# EAGLE design Auto2017 (EAGLE 7.7.0)
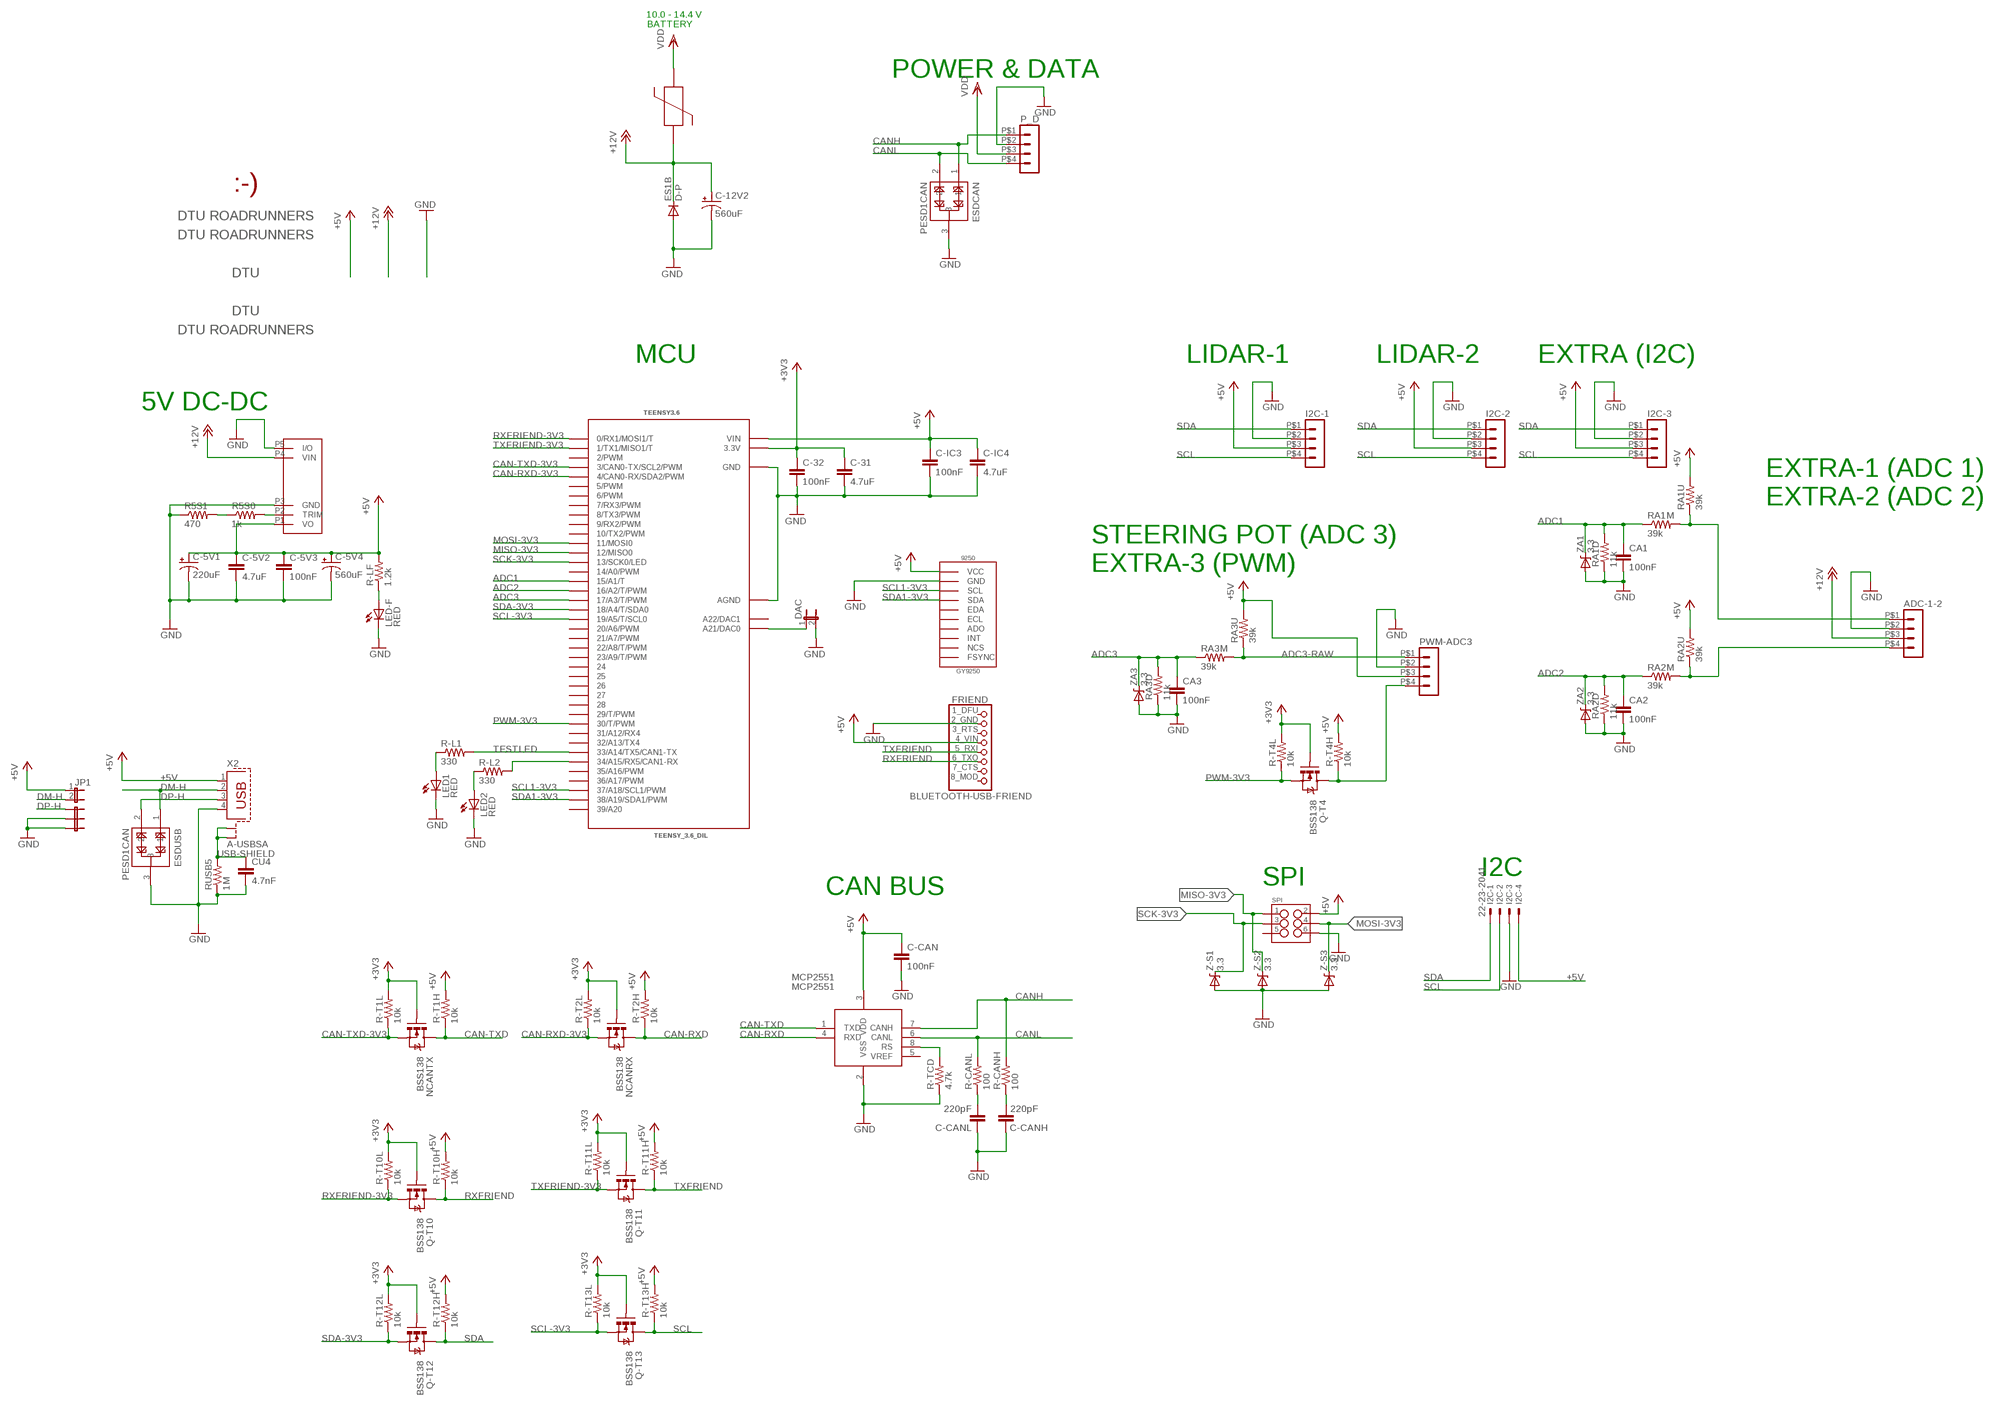
[diagram p0: schematic, sheet 1]

## Parts
9250  GY9250  [GY9250]
ADC-1-2  HEADER_POS4_43045-0401  [43045-0400]
C-5V1  220uF  CPOL-USD  [PANASONIC_D]
C-5V2  4.7uF  CAP1210  [1210]
C-5V3  100nF  CAP0805  [0805]
C-5V4  560uF  CPOL-USG  [PANASONIC_G]
C-12V2  560uF  CPOL-USG  [PANASONIC_G]
C-31  4.7uF  CAP1210  [1210]
C-32  100nF  CAP0805  [0805]
C-CAN  100nF  CAP0805  [0805]
C-CANH  220pF  CAP0805  [0805]
C-CANL  220pF  CAP0805  [0805]
C-IC3  100nF  CAP0805  [0805]
C-IC4  4.7uF  CAP1210  [1210]
CA1  100nF  CAP0805  [0805]
CA2  100nF  CAP0805  [0805]
CA3  100nF  CAP0805  [0805]
CU4  4.7nF  CAP0805  [0805]
D-P  ES1B  DIODESMA  [SMA-DIODE]
DAC  JUMPER-2PTH  [1X02]
ESDCAN  PESD1CAN  [SOT23-3]
ESDUSB  PESD1CAN  [SOT23-3]
FRIEND  BLUETOOTH-USB-FRIEND  [1X08_ROUND_76]
I2C  22-23-2041  [22-23-2041]
I2C-1  HEADER_POS4_43045-0401  [43045-0400]
I2C-2  HEADER_POS4_43045-0401  [43045-0400]
I2C-3  HEADER_POS4_43045-0401  [43045-0400]
JP1  JUMPER-2PTH  [1X02]
JP3  JUMPER-3PTH  [1X03]
LED1  RED  LED1206  [LED-1206]
LED2  RED  LED1206  [LED-1206]
LED-F  RED  LED1206  [LED-1206]
MAIN_FUSE  SMF_OMNI-BLOK_FUSE_BLOCK  [SMF_OMNI-BLOK_FUSE_BLOCK]
MCP2551  MCP2551  [SO-08M]
NCANRX  BSS138  MOSFET-NCHANNELBSS123LT1G  [SOT23-3]
NCANTX  BSS138  MOSFET-NCHANNELBSS123LT1G  [SOT23-3]
P_D  HEADER_POS4_43045-0401  [43045-0400]
PWM-ADC3  HEADER_POS4_43045-0401  [43045-0400]
Q-T4  BSS138  MOSFET-NCHANNELBSS123LT1G  [SOT23-3]
Q-T10  BSS138  MOSFET-NCHANNELBSS123LT1G  [SOT23-3]
Q-T11  BSS138  MOSFET-NCHANNELBSS123LT1G  [SOT23-3]
Q-T12  BSS138  MOSFET-NCHANNELBSS123LT1G  [SOT23-3]
Q-T13  BSS138  MOSFET-NCHANNELBSS123LT1G  [SOT23-3]
R5S0  1k  RESISTOR0805-RES  [0805]
R5S1  470  RESISTOR0805-RES  [0805]
R-CANH  100  RESISTOR0805-RES  [0805]
R-CANL  100  RESISTOR0805-RES  [0805]
R-L1  330  RESISTOR0805-RES  [0805]
R-L2  330  RESISTOR0805-RES  [0805]
R-LF  1.2k  RESISTOR0805-RES  [0805]
R-T1H  10k  RESISTOR0805-RES  [0805]
R-T1L  10k  RESISTOR0805-RES  [0805]
R-T2H  10k  RESISTOR0805-RES  [0805]
R-T2L  10k  RESISTOR0805-RES  [0805]
R-T4H  10k  RESISTOR0805-RES  [0805]
R-T4L  10k  RESISTOR0805-RES  [0805]
R-T10H  10k  RESISTOR0805-RES  [0805]
R-T10L  10k  RESISTOR0805-RES  [0805]
R-T11H  10k  RESISTOR0805-RES  [0805]
R-T11L  10k  RESISTOR0805-RES  [0805]
R-T12H  10k  RESISTOR0805-RES  [0805]
R-T12L  10k  RESISTOR0805-RES  [0805]
R-T13H  10k  RESISTOR0805-RES  [0805]
R-T13L  10k  RESISTOR0805-RES  [0805]
R-TCD  4.7k  RESISTOR0805-RES  [0805]
RA1D  11k  RESISTOR0805-RES  [0805]
RA1M  39k  RESISTOR0805-RES  [0805]
RA1U  39k  RESISTOR0805-RES  [0805]
RA2D  11k  RESISTOR0805-RES  [0805]
RA2M  39k  RESISTOR0805-RES  [0805]
RA2U  39k  RESISTOR0805-RES  [0805]
RA3D  11k  RESISTOR0805-RES  [0805]
RA3M  39k  RESISTOR0805-RES  [0805]
RA3U  39k  RESISTOR0805-RES  [0805]
RUSB5  1M  RESISTOR0805-RES  [0805]
SPI  M03X2POGO_PINS  [2X3_POGO]
TEENSY3.6  TEENSY_3.6_DIL  [TEENSY_3.6_DIL]
U$1  AXA003A0XZ  [SIP]
U$3  DTUMEDIUM-9MM  [DTU-MEDIUM-9MM]
U$4  ROADRUNNERSFULL  [ROADRUNNERS-FULL]
U$5  ROADRUNNERSSMALL  [ROADRUNNERS-SMALL]
U$6  SMILEY  [SMILEY]
U$8  DTUSMALL  [DTU-SMALL-5MM]
U$9  ROADRUNNERSFULL  [ROADRUNNERS-FULL]
X2  A-USBSA  [USB-A]
Z-S1  3.3  ZENER  [SOD123]
Z-S2  3.3  ZENER  [SOD123]
Z-S3  3.3  ZENER  [SOD123]
ZA1  3.3  ZENER  [SOD123]
ZA2  3.3  ZENER  [SOD123]
ZA3  3.3  ZENER  [SOD123]

## Nets
+3V3: C-31.1 C-32.1 NCANRX.1(G) NCANTX.1(G) Q-T4.1(G) Q-T10.1(G) Q-T11.1(G) Q-T12.1(G) Q-T13.1(G) R-T1L.2 R-T2L.2 R-T4L.2 R-T10L.2 R-T11L.2 R-T12L.2 R-T13L.2 TEENSY3.6.3.3V TEENSY3.6.3.3V3(3.3V)
+5V: 9250.P$VCC(VCC) C-5V1.+ C-5V2.1 C-5V3.1 C-5V4.+ C-CAN.1 C-IC3.1 C-IC4.1 FRIEND.4_VIN I2C-1.P$3 I2C-2.P$3 I2C-3.P$3 I2C.4 JP1.1 MCP2551.3(VDD) PWM-ADC3.P$3 R-LF.2 R-T1H.2 R-T2H.2 R-T4H.2 R-T10H.2 R-T11H.2 R-T12H.2 R-T13H.2 RA1U.2 RA2U.2 RA3U.2 SPI.P$2 TEENSY3.6.VIN U$1.P1(VO) X2.1
+12V: ADC-1-2.P$3 C-12V2.+ D-P.C MAIN_FUSE.PIN1 U$1.P4(VIN)
ADC1: CA1.1 RA1D.2 RA1M.1 TEENSY3.6.15/A1(15/A1/T) ZA1.C
ADC1-RAW: ADC-1-2.P$1 RA1M.2 RA1U.1
ADC2: CA2.1 RA2D.2 RA2M.1 TEENSY3.6.16/A2(16/A2/T/PWM) ZA2.C
ADC2-RAW: ADC-1-2.P$4 RA2M.2 RA2U.1
ADC3: CA3.1 RA3D.2 RA3M.1 TEENSY3.6.17/A3(17/A3/T/PWM) ZA3.C
ADC3-RAW: PWM-ADC3.P$1 RA3M.2 RA3U.1
CAN-RXD: MCP2551.4(RXD) NCANRX.3(D) R-T2H.1
CAN-RXD-3V3: NCANRX.2(S) R-T2L.1 TEENSY3.6.4(4/CAN0-RX/SDA2/PWM)
CAN-TXD: MCP2551.1(TXD) NCANTX.3(D) R-T1H.1
CAN-TXD-3V3: NCANTX.2(S) R-T1L.1 TEENSY3.6.3(3/CAN0-TX/SCL2/PWM)
CANH: ESDCAN.1 MCP2551.7(CANH) P_D.P$1 R-CANH.2
CANL: ESDCAN.2 MCP2551.6(CANL) P_D.P$4 R-CANL.2
DM-H: ESDUSB.1 JP1.2 X2.2
DP-H: ESDUSB.2 JP3.1 X2.3
GND: 9250.P$GND(GND) ADC-1-2.P$2 C-5V1.- C-5V2.2 C-5V3.2 C-5V4.- C-12V2.- C-31.2 C-32.2 C-CAN.2 C-CANH.1 C-CANL.1 C-IC3.2 C-IC4.2 CA1.2 CA2.2 CA3.2 CU4.2 D-P.A DAC.2 ESDCAN.3 ESDUSB.3 FRIEND.2_GND I2C-1.P$2 I2C-2.P$2 I2C-3.P$2 I2C.3 JP3.2 JP3.3 LED1.C LED2.C LED-F.C MCP2551.2(VSS) P_D.P$2 PWM-ADC3.P$2 R5S1.1 R-TCD.1 RA1D.1 RA2D.1 RA3D.1 RUSB5.1 SPI.P$6 TEENSY3.6.AGND TEENSY3.6.GND TEENSY3.6.GND1(GND) U$1.P3(GND) U$1.P5(I/O) X2.4 Z-S1.A Z-S2.A Z-S3.A ZA1.A ZA2.A ZA3.A
MISO-3V3: SPI.P$1 TEENSY3.6.12(12/MISO0) Z-S2.C
MOSI-3V3: SPI.P$4 TEENSY3.6.11(11/MOSI0) Z-S3.C
N$1: LED1.A R-L1.1
N$2: LED2.A R-L2.1
N$3: R5S0.1 R5S1.2
N$4: R-L2.2 TEENSY3.6.34/A15(34/A15/RX5/CAN1-RX)
N$5: DAC.1 TEENSY3.6.A21(A21/DAC0)
N$6: R5S0.2 U$1.P2(TRIM)
N$12: LED-F.A R-LF.1
N$25: C-CANL.2 R-CANL.1
N$26: C-CANH.2 R-CANH.1
PWM-3V3: Q-T4.2(S) R-T4L.1 TEENSY3.6.30(30/T/PWM)
PWM-5V: PWM-ADC3.P$4 Q-T4.3(D) R-T4H.1
RS: MCP2551.8(RS) R-TCD.2
RXFRIEND: FRIEND.6_TXO Q-T10.3(D) R-T10H.1
RXFRIEND-3V3: Q-T10.2(S) R-T10L.1 TEENSY3.6.0(0/RX1/MOSI1/T)
SCK-3V3: SPI.P$3 TEENSY3.6.13(13/SCK0/LED) Z-S1.C
SCL: I2C-1.P$4 I2C-2.P$4 I2C-3.P$4 I2C.2 Q-T13.3(D) R-T13H.1
SCL1-3V3: 9250.P$SCL(SCL) TEENSY3.6.37/A18(37/A18/SCL1/PWM)
SCL-3V3: Q-T13.2(S) R-T13L.1 TEENSY3.6.19/A5(19/A5/T/SCL0)
SDA: I2C-1.P$1 I2C-2.P$1 I2C-3.P$1 I2C.1 Q-T12.3(D) R-T12H.1
SDA1-3V3: 9250.P$SDA(SDA) TEENSY3.6.38/A19(38/A19/SDA1/PWM)
SDA-3V3: Q-T12.2(S) R-T12L.1 TEENSY3.6.18/A4(18/A4/T/SDA0)
TESTLED: R-L1.2 TEENSY3.6.33/A14(33/A14/TX5/CAN1-TX)
TXFRIEND: FRIEND.5_RXI Q-T11.3(D) R-T11H.1
TXFRIEND-3V3: Q-T11.2(S) R-T11L.1 TEENSY3.6.1(1/TX1/MISO1/T)
USB-SHIELD: CU4.1 RUSB5.2 X2.S1 X2.S2
VDD: MAIN_FUSE.PIN2 P_D.P$3
Unconnected: 9250.P$ADO(ADO) 9250.P$ECL(ECL) 9250.P$EDA(EDA) 9250.P$FSYNC(FSYNC) 9250.P$INT(INT) 9250.P$NCS(NCS) FRIEND.1_DFU FRIEND.3_RTS FRIEND.7_CTS FRIEND.8_MOD MCP2551.5(VREF) SPI.P$5 TEENSY3.6.2(2/PWM) TEENSY3.6.5(5/PWM) TEENSY3.6.6(6/PWM) TEENSY3.6.7(7/RX3/PWM) TEENSY3.6.8(8/TX3/PWM) TEENSY3.6.9(9/RX2/PWM) TEENSY3.6.10(10/TX2/PWM) TEENSY3.6.14/A0(14/A0/PWM) TEENSY3.6.20/A6(20/A6/PWM) TEENSY3.6.21/A7(21/A7/PWM) TEENSY3.6.22/A8(22/A8/T/PWM) TEENSY3.6.23/A9(23/A9/T/PWM) TEENSY3.6.24 TEENSY3.6.25 TEENSY3.6.26 TEENSY3.6.27 TEENSY3.6.28 TEENSY3.6.29(29/T/PWM) TEENSY3.6.31/A12(31/A12/RX4) TEENSY3.6.32/A13(32/A13/TX4) TEENSY3.6.35/A16(35/A16/PWM) TEENSY3.6.36/A17(36/A17/PWM) TEENSY3.6.39/A20 TEENSY3.6.A22(A22/DAC1)

## Notes on the sheet
- 10.0 - 14.4 V
- BATTERY
- POWER & DATA
- MCU | LIDAR-1 | LIDAR-2 | EXTRA (I2C)
- 5V DC-DC
- EXTRA-1 (ADC 1)
  EXTRA-2 (ADC 2)
- STEERING POT (ADC 3)
  EXTRA-3 (PWM)
- I2C
- SPI
- CAN BUS

## Library data of the parts
9250 = GY9250:GY9250: GY9250/6500 MPU-9250 module (3 axis accelerator, 3 axis gyro and 3 axis magnetometer) Chip: MPU9250; Power voltage: 3~5V Communication mode: I2C / SPI; Gyro range: +/-250, +/-500, +/-1000, +/-2000dps Accelerator range: +/-2G, +/-4G, +/-8G, +/-16G Magnetometer range: +/-4800uF Pin spacing: 2.54mm Bought from AliExpress <https://www.aliexpress.com/item/SPI-IIC-MPU-9250-9-Axis-Attitude-Gyro-Accelerator-Magnetometer-Sensor-Module/1893522629.html>
ADC-1-2 I2C-1-I2C-3 P_D PWM-ADC3 = con-molex-micro-fit-3_0:HEADER_POS4_?: Molex - Micro-Fit 3.0 Series connector, 3.00mm (0.118") pitch header, 4 positions.
C-5V1 C-5V4 C-12V2 = rcl:CPOL-US: POLARIZED CAPACITOR, American symbol
C-5V2 C-5V3 C-31 C-32 C-CAN C-CANH C-CANL C-IC3 C-IC4 CA1-CA3 CU4 = SparkFun-Passives:CAP: Capacitor Standard 0603 ceramic capacitor, and 0.1" leaded capacitor.
D-P = SparkFun-DiscreteSemi:DIODE: Diode These are standard reverse protection diodes and small signal diodes. SMA package can handle up to about 1A. SOD-323 can handle about 200mA. What the SOD-323 package when ordering, there are some mfgs out there that are 5-pin packages.
DAC JP1 = SparkFun-Retired:JUMPER-2: Jumper Basic 0.1" spaced jumper. Use with breakaway headers.
ESDCAN ESDUSB = SparkFun-DiscreteSemi:PESD1CAN: PESD1CAN is used to protect two automotive CAN bus lines from ESD.; PROD_ID: DIO-12501
FRIEND = BluetoothAndUSBFriend:BLUETOOTH-USB-FRIEND
I2C = con-molex:22-23-2041: .100" (2.54mm) Center Header - 4 Pin; MF: MOLEX; MPN: 22-23-2041; OC_FARNELL: 1462920; OC_NEWARK: 38C0355
JP3 = SparkFun-Retired:JUMPER-3
LED1 LED2 LED-F = SparkFun-LED:LED: LEDs Standard schematic elements and footprints for 5mm, 3mm, 1206, and 0603 sized LEDs. 5mm - Spark Fun Electronics SKU : COM-00529 (and others)
MAIN_FUSE = SMF_OMNI-BLOK_FUSE_BLOCK:SMF_OMNI-BLOK_FUSE_BLOCK
MCP2551 = skpang_lib:MCP2551
NCANRX NCANTX Q-T4 Q-T10-Q-T13 = SparkFun-DiscreteSemi:MOSFET-NCHANNEL: Common NMOSFET Parts MFG P/N Store ID Prod ID FDD8780 TRANS-09984 SI7820DN TRANS-11055 FDS6630A IC-08089 2N7002PW TRANS-11151 FQP30N06L COM-10213 TRANS-10060 BSS123LT1G TRANS-08345 BSS138 TRANS-00830 BS170 2N7000; PROD_ID: TRANS-08345
R5S0 R5S1 R-CANH R-CANL R-L1 R-L2 R-LF R-T1H R-T1L R-T2H R-T2L R-T4H R-T4L R-T10H R-T10L R-T11H R-T11L R-T12H R-T12L R-T13H R-T13L R-TCD RA1D RA1M RA1U RA2D RA2M RA2U RA3D RA3M RA3U RUSB5 = SparkFun-Resistors:RESISTOR: Resistor Basic schematic elements and footprints for 0603, 1206, and PTH resistors.
SPI = SparkFun-Connectors:M03X2: 2x3 .1" header. Shrouded, with keying- CONN-10681 SMT- CONN-11415 Pogo pins- HW-11044; PROD_ID: HW-11044
TEENSY3.6 = Teensy_3_and_LC_Series_Boards_v1.4:TEENSY_3.6_DIL: Teensy 3.6 DIL Package
U$1 = Austin-MiniLynx-DC-DC:AXA003A0XZ: Lineage Power Austin MiniLynx DC-DC Ikke-isoleret DC-DC-konverter, Udgang: 0.75 → 5.5V dc, Udgangsstrøm: 3A RS-varenummer:152-524 Fabrikant: Lineage Power Producentens varenummer: AXA003A0XZ
U$3 U$8 = Logos:DTU
U$4 U$5 U$9 = Logos:ROADRUNNERS
U$6 = Logos:SMILEY
X2 = AssmannUSB:A-USBSA
Z-S1-Z-S3 ZA1-ZA3 = diodes:ZENER

## Board
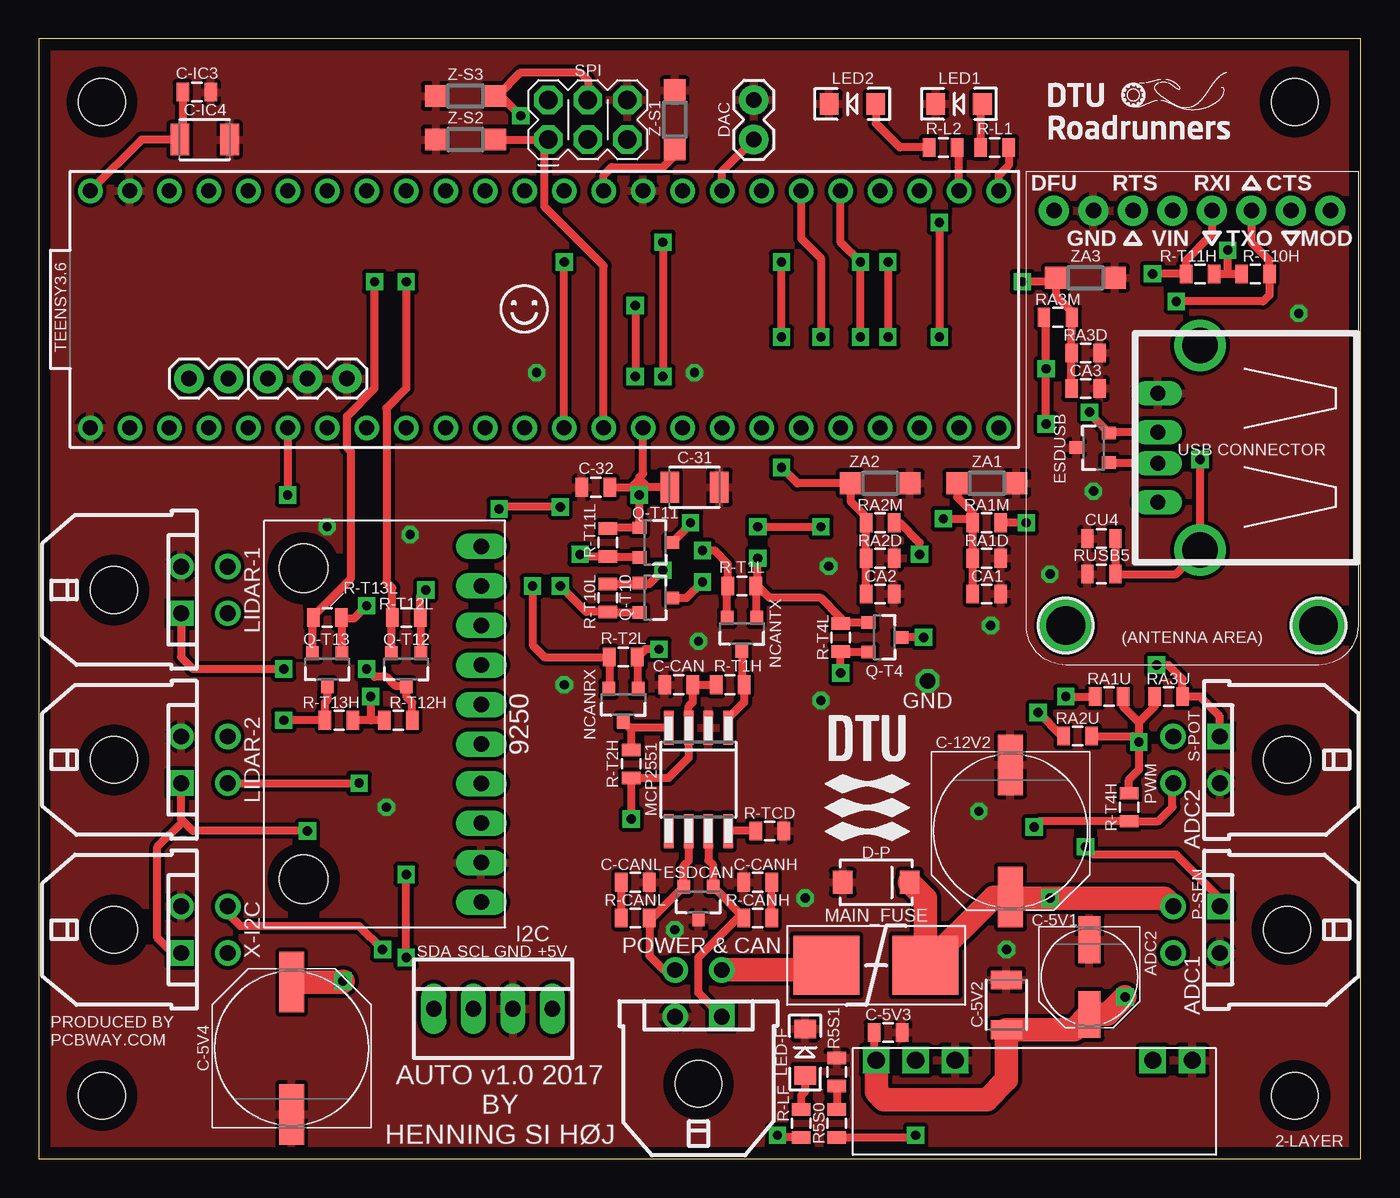
[diagram p1: board, top side]
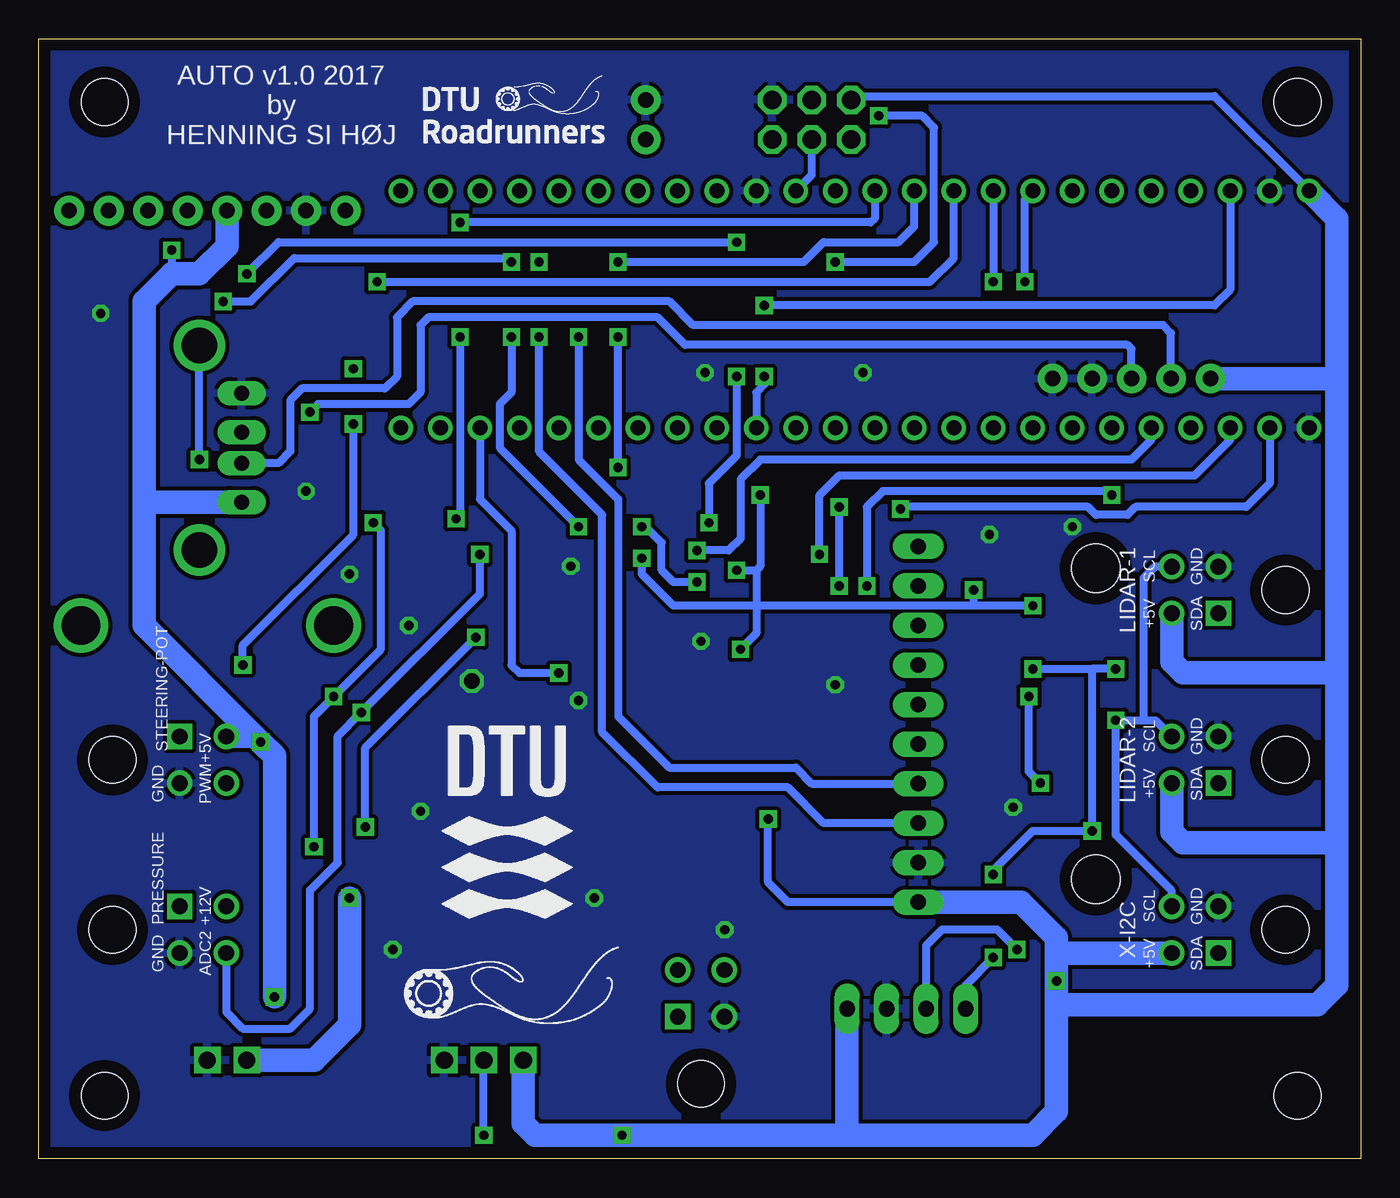
[diagram p2: board, bottom side, seen from below]

Size 85 x 72 mm. Coordinates in mm from the lower left corner, seen from the top.
Outline: 0,0 85,0 85,72 0,72 0,0
Copper layers (1*16): Top 0.035mm / dielectric 1.5mm / Bottom 0.035mm
Design rules "CustomSparkFun2Layer *": minimum track width 16mil, minimum drill 20mil, track to track 10mil, track to pad 8mil, pad to pad 8mil, via to via 8mil, smd to smd 8mil, copper to edge 30mil, drill to drill 8mil, minimum pad ring 12mil, minimum via ring 10mil, stop-mask expansion 4mil, vias tented up to drill 25mil, thermal gap 10mil
Holes 3 mm at 4.06,67.94 80.77,67.94 80.77,4.06 4.06,4.06

### Footprints (pad centres in the part's own frame; a part is rotated, then mirrored left to right if it is on the bottom)
GY9250 = drill 1.016 long: P$ADO 3.81,-6.35; P$ECL -1.27,-6.35; P$EDA 1.27,-6.35; P$FSYNC 11.43,-6.35; P$GND -8.89,-6.35; P$INT 6.35,-6.35; P$NCS 8.89,-6.35; P$SCL -6.35,-6.35; P$SDA -3.81,-6.35; P$VCC -11.43,-6.35 | hole 3.1: -9.97,5.08; 10.03,5.08
43045-0400 = drill 1.02 square: P$1 1.5,4.32 | drill 1.02: P$2 -1.5,4.32; P$3 1.5,7.32; P$4 -1.5,7.32 | hole 3: 0,0
PANASONIC_D = smd 3 x 1.4: + 2.4,0; - -2.4,0
1210 = smd 1.2 x 2: 1 -1.6,0; 2 1.6,0
0805 = smd 0.8 x 1.2: 1 -0.9,0; 2 0.9,0
PANASONIC_G = smd 3.9 x 1.6: + 4.25,0; - -4.25,0
SMA-DIODE = smd 1.27 x 1.47: A -2.15,0; C 2.15,0
1X02 = drill 1.016 pad 1.88: 1 0,0; 2 2.54,0
SOT23-3 = smd 0.8 x 0.9: 1 -0.95,-1; 2 0.95,-1; 3 0,1.1
1X08_ROUND_76 = drill 1 pad 1.93: 1_DFU 19.558,2.54; 2_GND 17.018,2.54; 3_RTS 14.478,2.54; 4_VIN 11.938,2.54; 5_RXI 9.398,2.54; 6_TXO 6.858,2.54; 7_CTS 4.318,2.54; 8_MOD 1.778,2.54 | drill 2.5 pad 3.2: P$1 2.54,29.21; P$2 18.796,29.21
22-23-2041 = drill 1 long: 1 -3.81,0; 2 -1.27,0; 3 1.27,0; 4 3.81,0
1X03 = drill 1.016 pad 1.88: 1 0,0; 2 2.54,0; 3 5.08,0
LED-1206 = smd 1.2 x 1.4: A -1.5,0; C 1.5,0
SMF_OMNI-BLOK_FUSE_BLOCK = smd 4.242 x 3.81: PIN1 -3.175,0; PIN2 3.2,0
SO-08M = smd 0.6 x 2.2: 1 -1.905,-3.33; 2 -0.635,-3.33; 3 0.635,-3.33; 4 1.905,-3.33; 5 1.905,3.33; 6 0.635,3.33; 7 -0.635,3.33; 8 -1.905,3.33
2X3_POGO = drill 1.2 pad 1.829 octagon: P$1 0,0; P$2 0,2.54; P$3 2.54,0; P$4 2.54,2.54; P$5 5.08,0; P$6 5.08,2.54
TEENSY_3.6_DIL = drill 0.965: 0 -7.62,25.4; 1 -7.62,22.86; 2 -7.62,20.32; 3 -7.62,17.78; 3.3V 7.62,22.86; 3.3V3 -7.62,-7.62; 4 -7.62,15.24; 5 -7.62,12.7; 6 -7.62,10.16; 7 -7.62,7.62; 8 -7.62,5.08; 9 -7.62,2.54; 10 -7.62,0; 11 -7.62,-2.54; 12 -7.62,-5.08; 13 7.62,-5.08; 14/A0 7.62,-2.54; 15/A1 7.62,0; 16/A2 7.62,2.54; 17/A3 7.62,5.08; 18/A4 7.62,7.62; 19/A5 7.62,10.16; 20/A6 7.62,12.7; 21/A7 7.62,15.24; 22/A8 7.62,17.78; 23/A9 7.62,20.32; 24 -7.62,-10.16; 25 -7.62,-12.7; 26 -7.62,-15.24; 27 -7.62,-17.78; 28 -7.62,-20.32; 29 -7.62,-22.86; 30 -7.62,-25.4; 31/A12 -7.62,-27.94; 32/A13 -7.62,-30.48; 33/A14 7.62,-30.48; 34/A15 7.62,-27.94; 35/A16 7.62,-25.4; 36/A17 7.62,-22.86; 37/A18 7.62,-20.32; 38/A19 7.62,-17.78; 39/A20 7.62,-15.24; A21 7.62,-12.7; A22 7.62,-10.16; AGND 7.62,25.4; GND -7.62,27.94; GND1 7.62,-7.62; VIN 7.62,27.94
SIP = drill 1.1 pad 1.626 square: P1 10.414,-3.048; P2 7.874,-3.048; P3 5.334,-3.048; P4 -7.366,-3.048; P5 -9.906,-3.048
USB-A = drill 0.95 long: 1 -3.5,2.71; 2 -1,2.71; 3 1,2.71; 4 3.5,2.71 | drill 2.3 pad 2.9: S1 -6.57,0; S2 6.57,0
SOD123 = smd 1.4 x 1.4: A 1.9,0; C -1.9,0

### Placement (x,y rotation side)
9250  22.1,27.94 90 top
ADC-1-2  80.26,14.73 90 top
C-5V1  67.56,11.68 270 top
C-5V2  62.23,9.91 90 top
C-5V3  54.61,8.13 0 top
C-5V4  16.26,7.11 90 top
C-12V2  62.48,21.08 270 top
C-31  42.16,43.18 0 top
C-32  35.81,43.18 180 top
C-CAN  41.15,30.48 180 top
C-CANH  46.23,17.78 0 top
C-CANL  38.35,17.78 180 top
C-IC3  10.16,68.58 0 top
C-IC4  10.67,65.53 0 top
CA1  60.96,36.32 0 top
CA2  54.1,36.32 0 top
CA3  67.31,49.53 0 top
CU4  68.33,39.88 180 top
D-P  53.85,17.78 0 top
DAC  45.97,65.53 90 top
ESDCAN  42.42,16.51 180 top
ESDUSB  67.82,45.72 90 top
FRIEND  84.84,63.5 180 top
I2C  29.21,9.65 0 top
I2C-1  4.83,14.73 270 top
I2C-2  4.83,25.65 270 top
I2C-3  4.83,36.58 270 top
JP1  9.65,50.16 0 top
JP3  14.73,50.16 0 top
LED1  59.18,67.82 180 top
LED2  52.32,67.82 180 top
LED-F  49.28,6.86 90 top
MAIN_FUSE  53.85,12.45 180 top
MCP2551  42.42,24.38 180 top
NCANRX  37.59,29.21 180 top
NCANTX  45.21,33.78 180 top
P_D  42.42,4.83 0 top
PWM-ADC3  80.26,25.65 90 top
Q-T4  54.36,33.53 270 top
Q-T10  39.62,36.07 270 top
Q-T11  39.62,39.62 270 top
Q-T12  23.62,31.5 180 top
Q-T13  18.54,31.5 180 top
R5S0  51.31,2.29 270 top
R5S1  51.31,5.59 270 top
R-CANH  46.23,15.49 180 top
R-CANL  38.35,15.49 0 top
R-L1  61.47,65.02 0 top
R-L2  58.17,65.02 0 top
R-LF  49.02,2.29 270 top
R-T1H  44.45,30.48 180 top
R-T1L  45.21,36.83 0 top
R-T2H  38.1,25.4 270 top
R-T2L  37.59,32.26 0 top
R-T4H  70.1,22.61 90 top
R-T4L  51.56,33.53 90 top
R-T10H  78.23,56.9 180 top
R-T10L  36.58,36.07 90 top
R-T11H  74.68,56.9 0 top
R-T11L  36.58,39.62 90 top
R-T12H  23.11,28.19 180 top
R-T12L  23.62,34.8 0 top
R-T13H  19.3,28.19 0 top
R-T13L  18.54,34.8 0 top
R-TCD  46.99,21.08 180 top
RA1D  60.96,38.61 180 top
RA1M  60.96,40.89 0 top
RA1U  68.83,29.72 0 top
RA2D  54.1,38.61 180 top
RA2M  54.1,40.89 0 top
RA2U  66.8,27.18 0 top
RA3D  67.31,51.82 180 top
RA3M  65.53,54.1 180 top
RA3U  72.64,29.72 180 top
RUSB5  68.33,37.59 0 top
SPI  32.77,65.53 0 top
TEENSY3.6  31.24,54.61 90 top
U$1  64.26,3.3 180 top
U$3  54.86,22.35 0 bottom
U$4  70.87,67.82 0 top
U$5  54.61,11.18 0 bottom
U$6  31.24,54.61 0 top
U$8  53.34,25.15 0 top
U$9  54.36,67.56 0 bottom
X2  74.68,45.72 90 top
Z-S1  40.89,66.8 90 top
Z-S2  27.43,65.53 180 top
Z-S3  27.43,68.33 180 top
ZA1  60.96,43.43 0 top
ZA2  54.1,43.43 0 top
ZA3  67.31,56.64 0 top

### Tracks (layer width: path | path; a pad name or v marks a point on that pad's centre or on a via)
+3V3  (via drill 0.6)
  Top 0.508: Q-T13.1 19.49,34.75 | 19.49,34.75 R-T13L.2 | Q-T12.1 24.57,34.75 R-T12L.2 24.52,36.21 v24.89,36.58 | NCANRX.1 38.49,30.26 R-T2L.2 39,32.77 v39.88,32.77 | 36.63,37.02 R-T10L.2 38.61,36.97 | R-T11L.2 36.63,40.57 Q-T11.1 38.62,42.15 | 38.62,43.69 38.62,43.82 38.86,44.06 TEENSY3.6.3.3V3 | NCANTX.1 46.16,36.78 | 46.16,36.78 R-T1L.2 46.23,36.95 | Q-T4.1 51.61,34.48 R-T4L.2 51.56,34.8 50.29,36.07 46.99,36.07 46.35,36.7 46.28,36.78 | v38.35,54.86 v38.35,50.29 | C-32.1 38.12,43.18 38.62,43.69 | C-31.1 39.13,43.18 38.62,43.69 | 38.61,36.97 39.25,36.97 v40.13,37.85 | 19.49,34.75 20.27,34.75 v21.08,35.56 | 46.28,36.78 46.23,36.83 v46.23,38.61 | 38.62,42.15 v38.61,42.67 | 38.62,42.15 38.62,43.69 | Q-T10.1 38.62,36.98 38.61,36.97 | 46.16,36.78 46.28,36.78
  Bottom 0.508: TEENSY3.6.3.3V 8.38,55.88 9.4,54.86 v38.35,54.86 | v38.35,50.29 38.35,49.78 38.86,49.28 TEENSY3.6.3.3V3 | 38.86,35.56 44.2,35.56 46.23,37.59 v46.23,38.61 | 38.86,37.85 38.86,35.56 | 38.86,35.56 38.86,33.78 v39.88,32.77 | v40.13,37.85 38.86,37.85 | v21.08,35.56 24.89,35.56 | 24.89,35.56 38.86,35.56 | v24.89,36.58 24.89,35.56 | v38.61,42.67 38.61,38.1 38.86,37.85
+5V  (via drill 0.6)
  Top 0.508: R-T11H.2 76.45,56.9 | 76.45,56.9 R-T10H.2 | R-T1H.2 C-CAN.1 42.05,29.35 41.78,29.08 MCP2551.3 41.78,25.78 40.5,24.5 R-T2H.2 v38.1,21.84 | C-5V3.1 53.71,6.49 U$1.P1 | R-LF.2 47.89,1.39 v47.5,1.52 | C-IC3.1 9.26,65.72 C-IC4.1 6.6,65.53 TEENSY3.6.VIN | R-T12H.2 21.34,28.19 | 21.34,28.19 R-T13H.2 | v21.34,29.72 21.34,28.19 | I2C-2.P$3 v20.6,24.15 | R-T4H.2 70.1,24.38 70.74,25.02 v70.74,26.8 | 70.74,28.07 v70.74,26.8 | RA2U.2 70.36,27.18 v70.74,26.8 | RA3U.2 71.74,29.07 70.74,28.07 | RA1U.2 69.73,29.07 70.74,28.07 | 76.45,56.9 v76.45,58.42
  Top 1.524: U$1.P1 53.85,4.32 54.36,3.81 60.96,3.81 62.23,5.08 C-5V2.1 66.59,8.31 C-5V1.+ 68.72,9.28 v69.85,10.41 | C-5V4.+ 19.49,11.36 v19.56,11.43
  Bottom 0.508: TEENSY3.6.VIN 9.4,68.33 32.51,68.33 SPI.P$2 | 12.17,35.05 I2C-3.P$3 | v21.34,29.72 21.34,24.89 v20.6,24.15 | 9250.P$VCC 36.83,16.51 38.1,17.78 v38.1,21.84 | v76.45,58.42 76.45,56.9
  Bottom 1.524: v69.85,10.41 69.85,25.91 v70.74,26.8 71.12,27.18 | 71.12,27.18 72.92,27.18 PWM-ADC3.P$3 | 71.12,27.18 78.23,34.29 78.23,42.42 | 78.23,42.42 78.23,55.12 76.45,56.9 74.68,56.9 72.9,58.67 FRIEND.4_VIN | X2.1 78.03,42.22 78.23,42.42 | 19.56,9.4 v19.56,11.43 19.56,12.95 | 19.56,9.4 19.56,3.05 21.08,1.52 33.27,1.52 | 33.27,1.52 v47.5,1.52 53.09,1.52 53.85,2.29 U$1.P1 | 19.56,12.95 19.56,14.22 21.84,16.51 9250.P$VCC | I2C-1.P$3 19.28,13.23 19.56,12.95 | I2C-2.P$3 12.15,21.04 11.43,20.32 1.52,20.32 | 1.52,20.32 1.52,11.18 2.79,9.91 19.05,9.91 19.56,9.4 | 1.52,20.32 1.52,31.24 | 1.52,31.24 1.52,49.78 | 1.52,49.78 1.52,60.45 TEENSY3.6.VIN | I2C.4 33.02,1.78 33.27,1.52 | JP1.1 1.91,50.16 1.52,49.78 | I2C-3.P$3 12.15,31.96 11.43,31.24 1.52,31.24
+12V  (via drill 0.6)
  Top 1.524: D-P.C 57.02,16.75 MAIN_FUSE.PIN1 61.41,16.83 C-12V2.+ 62.55,16.76 v65.02,16.76 72.39,16.76 72.92,16.23 ADC-1-2.P$3
  Bottom 1.524: v65.02,16.76 65.02,8.64 67.31,6.35 U$1.P4
ADC1  (via drill 0.6)
  Top 0.508: RA1M.1 60.06,41.54 59.06,42.54 ZA1.C | RA1M.1 RA1D.2 CA1.1 | v57.91,60.2 v57.91,52.83 | v58.17,41.15 59.81,41.15 RA1M.1
  Bottom 0.508: TEENSY3.6.15/A1 31.24,60.45 31.5,60.2 v57.91,60.2 | v57.91,52.83 57.91,41.4 v58.17,41.15
ADC1-RAW  (via drill 0.6)
  Top 0.508: ADC-1-2.P$1 75.94,16.77 73.15,19.56 67.82,19.56 v67.31,20.07 | v66.04,29.72 RA1U.1 | v63.5,40.89 RA1M.2
  Bottom 0.508: v67.31,20.07 67.31,28.45 v66.04,29.72 62.99,32.77 62.99,40.39 v63.5,40.89
ADC2  (via drill 0.6)
  Top 0.508: CA2.1 RA2D.2 RA2M.1 53.2,41.29 52.2,42.29 ZA2.C 48.77,43.43 v47.75,44.45 | v47.75,52.83 v47.75,57.66
  Bottom 0.508: v47.75,44.45 v47.75,52.83 | v47.75,57.66 35.81,57.66 34.54,58.93 29.72,58.93 28.7,59.94 TEENSY3.6.16/A2
ADC2-RAW  (via drill 0.6)
  Top 0.508: RA2U.1 65.79,27.18 v64.26,28.7 | v56.64,38.86 56.64,39.62 55.37,40.89 RA2M.2
  Bottom 0.508: ADC-1-2.P$4 72.94,9.44 71.88,8.38 68.83,8.38 67.56,9.65 67.56,17.27 65.79,19.05 65.79,27.18 v64.26,28.7 56.64,36.32 v56.64,38.86
ADC3  (via drill 0.6)
  Top 0.508: CA3.1 RA3D.2 RA3M.1 66.41,54.49 65.41,55.49 ZA3.C 65.28,56.64 65.02,56.39 v63.25,56.39
  Bottom 0.508: v63.25,56.39 27.69,56.39 26.16,57.91 TEENSY3.6.17/A3
ADC3-RAW  (via drill 0.6)
  Top 0.508: PWM-ADC3.P$1 75.94,28.45 74.68,29.72 RA3U.1 73.54,30.85 72.64,31.75 v71.88,31.75 | v64.77,47.24 v64.77,50.8 64.77,53.96 RA3M.2
  Bottom 0.508: v71.88,31.75 71.88,33.02 64.77,40.13 v64.77,47.24
CAN-RXD
  Top 0.508: MCP2551.4 38.1,27.71 | 38.1,27.71 37.99,27.71 NCANRX.3 | R-T2H.1 38.1,27.71
CAN-RXD-3V3  (via drill 0.6)
  Top 0.508: NCANRX.2 36.69,30.26 R-T2L.1 32.51,32.26 31.75,33.02 v31.75,36.83 | TEENSY3.6.4 v16,42.67
  Bottom 0.508: v16,42.67 16.26,42.93 30.73,42.93 31.75,41.91 v31.75,36.83
CAN-TXD
  Top 0.508: MCP2551.1 44.32,28.32 45.35,29.35 R-T1H.1 45.21,30.62 NCANTX.3
CAN-TXD-3V3  (via drill 0.6)
  Top 0.508: NCANTX.2 44.26,36.78 R-T1L.1 44.31,38.24 43.43,39.12 v42.67,39.12
  Bottom 0.508: TEENSY3.6.3 13.46,46.23 14.73,44.96 38.61,44.96 39.88,43.69 39.88,39.88 40.64,39.12 v42.67,39.12
CANH
  Top 0.508: MCP2551.7 43.05,19.18 43.37,18.86 ESDCAN.1 45.33,15.55 R-CANH.2 44.96,15.49 42.42,12.95 42.42,10.67 43.92,9.17 P_D.P$1
CANL
  Top 0.508: MCP2551.6 41.78,19.18 41.47,18.86 ESDCAN.2 39.45,15.49 R-CANL.2 39.25,13.07 40.18,12.15 P_D.P$4
DM-H
  Top 0.508: X2.2 68.87,44.72 ESDUSB.1
  Bottom 0.508: JP1.2 12.19,53.09 12.7,53.59 42.93,53.59 44.45,55.12 60.96,55.12 61.98,54.1 61.98,50.29 62.74,49.53 68.07,49.53 68.83,48.77 68.83,45.48 69.6,44.72 X2.2
DP-H  (via drill 0.6)
  Top 0.508: X2.3 68.87,46.72 ESDUSB.2 67.56,47.92 v67.56,48.01
  Bottom 0.508: JP3.1 14.73,52.07 14.99,52.32 43.43,52.32 45.21,54.1 59.94,54.1 60.45,53.59 60.45,49.28 61.21,48.51 67.06,48.51 v67.56,48.01
GND  (via drill 0.6, 1)
  other vias: 40.89,14.73 49.28,16.76 23.88,40.13 18.54,40.64 32,50.55 42.16,50.55 67.82,42.93 50.8,38.1 50.29,29.46 61.21,34.29 42.42,33.27 33.78,30.48 62.23,13.46 60.45,22.35 22.35,22.61 65.02,37.59 81.03,54.36 57.15,30.73
  pour Top: -2.54,75.69 91.19,75.69 91.19,-4.83 -2.54,-4.83
  pour Bottom: -2.54,75.69 91.19,75.69 91.19,-4.83 -2.54,-4.83
MISO-3V3
  Top 0.508: Z-S2.C SPI.P$1 32.51,65.28 32.51,61.21 36.32,57.4 TEENSY3.6.12
MOSI-3V3  (via drill 0.6)
  Top 0.508: SPI.P$4 35.31,69.34 34.8,69.85 30.99,69.85 29.59,68.45 Z-S3.C 29.72,68.33 v30.99,67.06 | TEENSY3.6.11 v33.78,57.66
  Bottom 0.508: v33.78,57.66 28.7,57.66 27.43,58.93 27.43,66.29 28.19,67.06 v30.99,67.06
N$1
  Top 0.508: R-L1.1 60.57,67.7 LED1.A
N$2
  Top 0.508: R-L2.1 55.37,65.02 53.82,66.57 LED2.A
N$3
  Top 0.508: R5S1.2 R5S0.1
N$4
  Top 0.508: TEENSY3.6.34/A15 59.18,64.91 R-L2.2
N$5
  Top 0.508: TEENSY3.6.A21 43.94,63.5 DAC.1
N$6  (via drill 0.6)
  Top 0.508: R5S0.2 56.25,1.39 v56.39,1.52
  Bottom 0.508: v56.39,1.52 U$1.P2
N$12
  Top 0.508: LED-F.A 49.28,4.32 49.02,4.06 R-LF.1
N$25
  Top 0.508: R-CANL.1 C-CANL.2
N$26
  Top 0.508: R-CANH.1 C-CANH.2
PWM-3V3  (via drill 0.6)
  Top 0.508: Q-T4.2 51.61,32.58 R-T4L.1 v51.56,31.24
  Bottom 0.508: TEENSY3.6.30 56.64,42.42 54.61,40.39 54.61,31.75 54.1,31.24 v51.56,31.24
PWM-5V  (via drill 0.6)
  Top 0.508: 55.37,33.61 Q-T4.3 v56.9,33.53 | PWM-ADC3.P$4 72.9,24.11 72.9,22.61 72,21.71 R-T4H.1 64.38,21.71 v64.01,21.34
  Bottom 0.508: v64.01,21.34 64.01,26.42 v56.9,33.53
RS
  Top 0.508: R-TCD.2 44.35,21.08 MCP2551.8
RXFRIEND  (via drill 0.6)
  Top 0.508: FRIEND.6_TXO 77.98,58.93 79.13,57.77 R-T10H.1 79.13,55.51 78.74,55.12 v73.15,55.12 | v54.61,57.66 v54.61,52.83 | Q-T10.3 41.66,36.07 v42.67,37.08 | v46.23,40.64 v50.29,40.64
  Bottom 0.508: v73.15,55.12 71.37,55.12 68.58,57.91 54.86,57.91 v54.61,57.66 | v54.61,52.83 54.61,49.28 55.37,48.51 55.37,45.72 v50.29,40.64 | v42.67,37.08 44.2,37.08 44.96,37.85 44.96,39.62 45.97,40.64 v46.23,40.64
RXFRIEND-3V3  (via drill 0.6)
  Top 0.508: Q-T10.2 36.63,35.12 R-T10L.1 35.19,35.17 v33.53,36.83 | v33.53,41.91 29.72,41.91 v29.59,41.78
  Bottom 0.508: TEENSY3.6.0 5.84,43.43 7.37,41.91 14.48,41.91 14.99,41.4 17.02,41.4 17.53,41.91 29.46,41.91 v29.59,41.78 | v33.53,36.83 v33.53,41.91
SCK-3V3
  Top 0.508: TEENSY3.6.13 36.32,63.25 36.83,63.75 40.13,63.75 40.89,64.52 Z-S1.C
  Bottom 0.508: SPI.P$3 35.31,63.25 TEENSY3.6.13
SCL  (via drill 0.6)
  Top 0.508: Q-T13.3 18.54,29.46 18.4,29.33 R-T13H.1 v15.75,28.19 | I2C-1.P$4 12.15,15.79 12.95,14.99 20.57,14.99 v22.1,13.46
  Bottom 0.508: 13.97,28.19 v15.75,28.19 15.75,20.83 12.15,17.23 I2C-1.P$4 | 13.97,28.19 13.19,28.19 I2C-2.P$4 | I2C-3.P$4 13.23,38.08 13.97,37.34 13.97,28.19 | v22.1,13.46 23.37,14.73 26.92,14.73 27.94,13.72 I2C.2
SCL1-3V3  (via drill 0.6)
  Top 0.508: v52.83,52.83 v52.83,57.66 51.56,58.93 TEENSY3.6.37/A18
  Bottom 0.508: 9250.P$SCL 34.54,21.59 36.83,23.88 45.21,23.88 48.77,27.43 48.77,41.4 52.83,45.47 v52.83,52.83 | v52.83,57.66 52.83,57.4
SCL-3V3  (via drill 0.6)
  Top 0.508: R-T13L.1 17.59,34.75 Q-T13.2 17.59,34.86 20.07,37.34 20.07,45.47 19.81,45.72 19.81,47.75 21.59,49.53 v21.59,56.39
  Bottom 0.508: v21.59,56.39 21.59,61.72 TEENSY3.6.19/A5
SDA  (via drill 0.6)
  Top 0.508: R-T12H.1 24.01,29.33 23.62,29.72 Q-T12.3 22.94,30.4 22.35,30.99 21.59,30.99 v21.08,31.5 | v17.27,21.08 9.91,21.08 9.27,21.72 | 9.27,21.72 9.14,21.84 I2C-2.P$1 | I2C-1.P$1 8.61,13.23 7.62,14.22 7.62,20.07 9.27,21.72 | I2C-3.P$1 9.15,32.26 9.91,31.5 v15.75,31.5 | v23.62,12.95 v23.62,18.29
  Bottom 0.508: v21.08,31.5 17.27,31.5 | 17.27,31.5 v17.27,21.08 21.08,21.08 23.62,18.54 v23.62,18.29 | v15.75,31.5 17.27,31.5 | I2C.1 25.4,11.18 v23.62,12.95
SDA1-3V3  (via drill 0.6)
  Top 0.508: TEENSY3.6.38/A19 49.02,59.18 50.29,57.91 v50.29,52.83
  Bottom 0.508: v50.29,52.83 50.29,44.96 47.75,42.42 47.75,28.45 44.45,25.15 36.32,25.15 35.31,24.13 9250.P$SDA
SDA-3V3  (via drill 0.6)
  Top 0.508: Q-T12.2 22.67,34.75 R-T12L.1 22.72,36.71 22.35,37.08 22.35,48.26 23.62,49.53 v23.62,56.39
  Bottom 0.508: TEENSY3.6.18/A4 v23.62,56.39
TESTLED
  Top 0.508: TEENSY3.6.33/A14 61.72,63.25 62.37,63.89 R-L1.2
TXFRIEND  (via drill 0.6)
  Top 0.508: FRIEND.5_RXI 75.44,59.44 73.78,57.77 R-T11H.1 v71.63,56.9 | v40.13,58.93 v40.13,50.29 | v41.91,40.89 41.91,40.81 Q-T11.3
  Bottom 0.508: v71.63,56.9 69.6,58.93 v40.13,58.93 | v40.13,50.29 40.13,45.21 41.91,43.43 v41.91,40.89
TXFRIEND-3V3  (via drill 0.6)
  Top 0.508: Q-T11.2 36.63,38.67 R-T11L.1 34.94,38.72 v34.8,38.86
  Bottom 0.508: v34.8,38.86 34.8,42.67 33.53,43.94 10.67,43.94 8.38,46.23 TEENSY3.6.1
USB-SHIELD  (via drill 0.6)
  Top 0.508: CU4.1 RUSB5.2 73.12,37.59 X2.S1 v74.68,44.96
  Bottom 0.508: v74.68,44.96 X2.S2
VDD
  Top 1.524: P_D.P$3 50.35,12.15 MAIN_FUSE.PIN2

### Text on the board
tPlace: LIDAR-1 | __ | GND | S-POT | LIDAR-2 | PWM | ADC2 | P-SEN | X-I2C | SDA | SCL | GND | +5V | POWER & CAN | ADC2 | ADC1 | PRODUCED BY / PCBWAY.COM | AUTO v1.0 2017 / BY / HENNING SI HØJ | 2-LAYER
bPlace: AUTO v1.0 2017 / by / HENNING SI HØJ | GND | SCL | LIDAR-1 | SDA | +5V | STEERING-POT | GND | SCL | LIDAR-2 | +5V | SDA | +5V | PWM | GND | PRESSURE | GND | SCL | +12V | X-I2C | SDA | +5V | ADC2 | GND
Measures: _